# EAGLE design ESP32 TFT Touch with camera v1.2(3.5'' ili9488) (EAGLE 6.1)
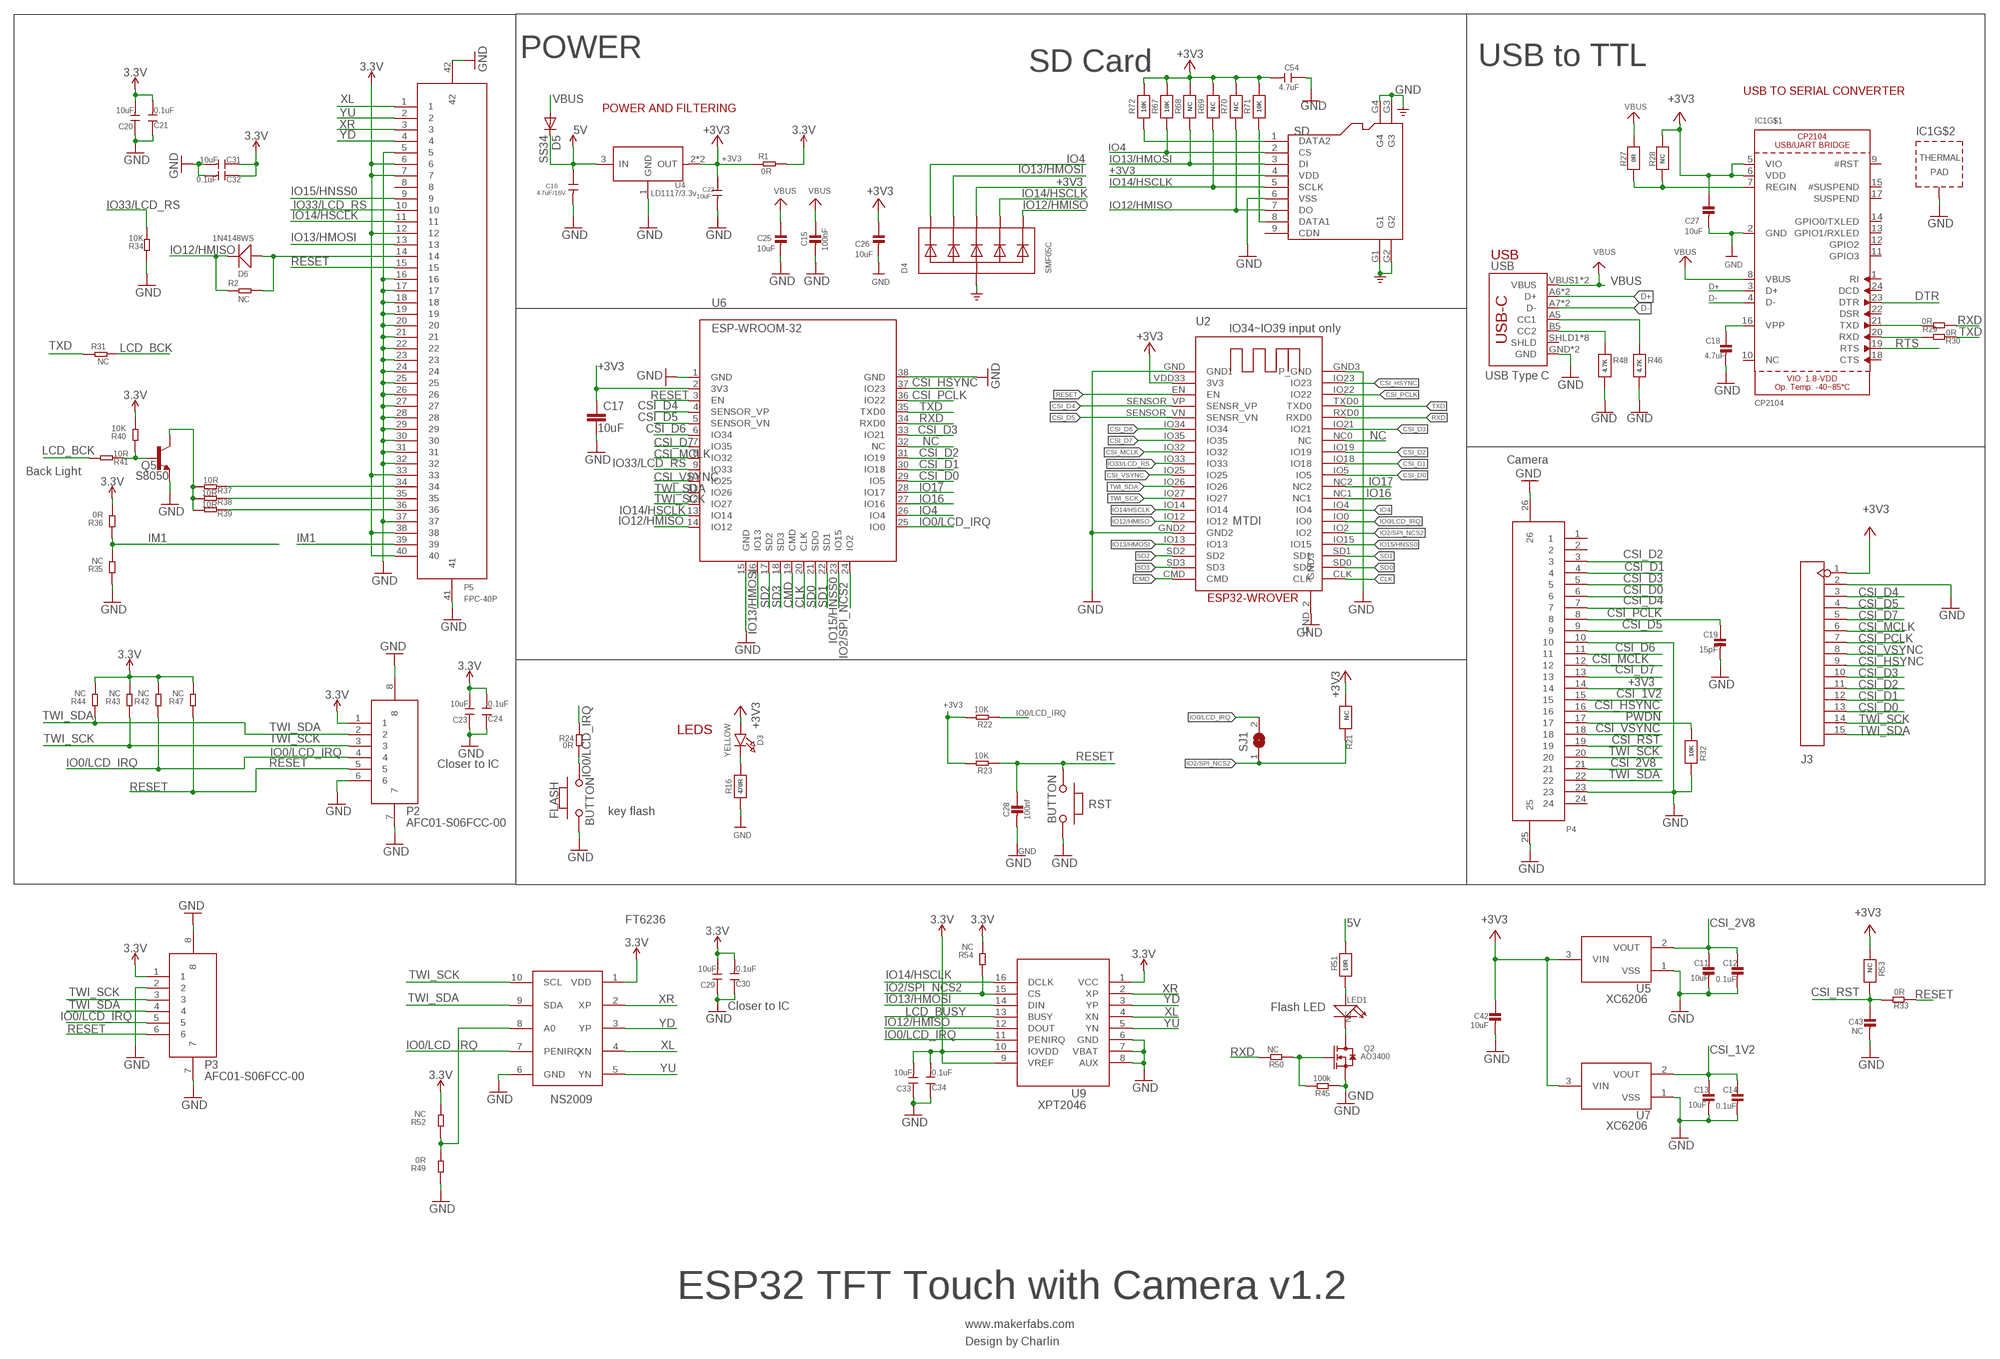
[diagram p0: schematic, sheet 1, part 1 of 2]
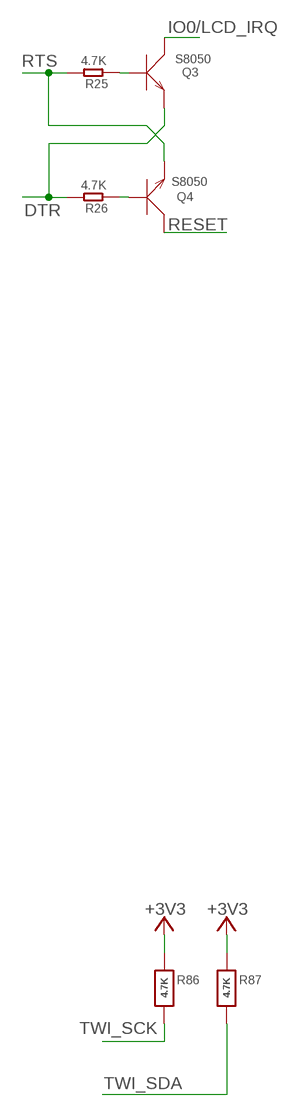
[diagram p1: schematic, sheet 1, part 2 of 2]

## Parts
C11  10uF  CAP_CERAMIC0603_NO  [0603-NO]
C12  0.1uF  CAP_CERAMIC0603_NO  [0603-NO]
C13  10uF  CAP_CERAMIC0603_NO  [0603-NO]
C14  0.1uF  CAP_CERAMIC0603_NO  [0603-NO]
C15  100nF  CAP_CERAMIC0603_NO  [0603-NO]
C16  4.7uF/16V  C-0603  [0603]
C17  10uF  C-EUC0603  [C0603]
C18  4.7uF  CAP_CERAMIC0603_NO  [0603-NO]
C19  15pF  CAP_CERAMIC0603_NO  [0603-NO]
C20  10uF  DISCRETE_C-0603  [DISCRETE_C0603]
C21  0.1uF  DISCRETE_C-0603  [DISCRETE_C0603]
C22  10uF  C-0603  [0603]
C23  10uF  DISCRETE_C-0603  [DISCRETE_C0603]
C24  0.1uF  DISCRETE_C-0603  [DISCRETE_C0603]
C25  10uF  CAP_CERAMIC0603_NO  [0603-NO]
C26  10uF  CAP_CERAMIC0603_NO  [0603-NO]
C27  10uF  CAP_CERAMIC0603_NO  [0603-NO]
C28  100nf  CAP_CERAMIC0603_NO  [0603-NO]
C29  10uF  DISCRETE_C-0603  [DISCRETE_C0603]
C30  0.1uF  DISCRETE_C-0603  [DISCRETE_C0603]
C31  10uF  DISCRETE_C-0603  [DISCRETE_C0603]
C32  0.1uF  DISCRETE_C-0603  [DISCRETE_C0603]
C33  10uF  DISCRETE_C-0603  [DISCRETE_C0603]
C34  0.1uF  DISCRETE_C-0603  [DISCRETE_C0603]
C42  10uF  CAP_CERAMIC0603_NO  [0603-NO]
C43  NC  CAP_CERAMIC0603_NO  [0603-NO]
C54  4.7uF  DISCRETE_C-0603  [DISCRETE_C0603]
D3  YELLOW  LED0805_NOOUTLINE  [CHIPLED_0805_NOOUTLINE]
D4  SMF05C  TVSARRAY_5LANE  [SOT363]
D5  SS34  DIODE-DO-214AC  [DO-214AC]
D6  1N4148WS  D'0805'  [SOD323]
FLASH  BUTTON  PB157  [157SW]
IC1  CP2104  [QFN24_4MM_SMSC]
J3  HEADER-1X15P  [SMD15-2.54P8.5H]
LED1  NC  DISCRETE_LED3528  [DISCRETE_LED-3528]
P2  AFC01-S06FCC-00  [SMD8-50P-740L535W]
P3  AFC01-S06FCC-00  [SMD8-50P-740L535W]
P4  FPC-24P  [SMD26-50P-1760L450W]
P5  FPC-40P  [SMD42-50P-2560L490W]
Q2  AO3400  MOSFET-N'SOT23'  [SOT23@1]
Q3  S8050  TRANSISTOR-NPN-SOT23  [SOT23]
Q4  S8050  TRANSISTOR-NPN-SOT23  [SOT23]
Q5  S8050  SPARKFUN_TRANSISTOR_NPNSOT23  [SPARKFUN_SOT23]
R1  0R  R-0603  [R0603]
R2  NC  R-0603  [R0603]
R16  470R  RESISTOR_0603_NOOUT  [0603-NO]
R21  NC  RESISTOR_0603_NOOUT  [0603-NO]
R22  10K  R-0603  [R0603]
R23  10K  R-0603  [R0603]
R24  0R  R-0603  [R0603]
R25  4.7K  R-0603  [R0603]
R26  4.7K  R-0603  [R0603]
R27  0R  RESISTOR_0603_NOOUT  [0603-NO]
R28  NC  RESISTOR_0603_NOOUT  [0603-NO]
R29  0R  R-0603  [R0603]
R30  0R  R-0603  [R0603]
R31  NC  R-0603  [R0603]
R32  10K  RESISTOR_0603_NOOUT  [0603-NO]
R33  0R  R-0603  [R0603]
R34  10K  DISCRETE_R-0603  [DISCRETE_R0603]
R35  NC  DISCRETE_R-0603  [DISCRETE_R0603]
R36  0R  DISCRETE_R-0603  [DISCRETE_R0603]
R37  10R  DISCRETE_R-0603  [DISCRETE_R0603]
R38  10R  DISCRETE_R-0603  [DISCRETE_R0603]
R39  10R  DISCRETE_R-0603  [DISCRETE_R0603]
R40  10K  DISCRETE_R-0603  [DISCRETE_R0603]
R41  10R  DISCRETE_R-0603  [DISCRETE_R0603]
R42  NC  DISCRETE_R-0603  [DISCRETE_R0603]
R43  NC  DISCRETE_R-0603  [DISCRETE_R0603]
R44  NC  DISCRETE_R-0603  [DISCRETE_R0603]
R45  100k  R-0603  [R0603]
R46  4.7K  RESISTOR_0603_NOOUT  [0603-NO]
R47  NC  DISCRETE_R-0603  [DISCRETE_R0603]
R48  4.7K  RESISTOR_0603_NOOUT  [0603-NO]
R49  0R  DISCRETE_R-0603  [DISCRETE_R0603]
R50  NC  R-0603  [R0603]
R51  10R  RESISTOR_0603_NOOUT  [0603-NO]
R52  NC  DISCRETE_R-0603  [DISCRETE_R0603]
R53  NC  RESISTOR_0603_NOOUT  [0603-NO]
R54  NC  DISCRETE_R-0603  [DISCRETE_R0603]
R67  10K  RESISTOR_0603_NOOUT  [0603-NO]
R68  NC  RESISTOR_0603_NOOUT  [0603-NO]
R69  NC  RESISTOR_0603_NOOUT  [0603-NO]
R70  NC  RESISTOR_0603_NOOUT  [0603-NO]
R71  10K  RESISTOR_0603_NOOUT  [0603-NO]
R72  10K  RESISTOR_0603_NOOUT  [0603-NO]
R86  4.7K  RESISTOR_0603_NOOUT  [0603-NO]
R87  4.7K  RESISTOR_0603_NOOUT  [0603-NO]
RST  BUTTON  PB157  [157SW]
SD  HOLDER-MICROSD-9P  [9P-SMD-W/-RING]
SJ1  SJ  [SJ]
U2  ESP32-WROVER  [ESP32-WROVER]
U4  LD1117/3.3v  LD1117'SOT89'  [SOT89]
U5  XC6206  [SOT-23]
U6  ESP-WROOM-32  [ESP-WROOM-32]
U7  XC6206  [SOT-23]
U8  NS2009  [MSOP10]
U9  XPT2046  [TSSOP16-65P-560L910W]
USB  USB_C5  [USB-C-16P-5]

## Nets
3.3V: C20.2 C21.2 C23.2 C24.2 C29.2 C30.2 C31.1 C32.1 C33.2 C34.2 P2.1 P3.1 P5.6 P5.7 P5.12 P5.33 P5.38 P5.40 R1.2 R36.2 R40.2 R42.2 R43.2 R44.2 R47.2 R52.2 R54.2 U8.1(VDD) U9.1(VCC) U9.9(VREF) U9.10(IOVDD)
5V: C16.1 D5.C R51.1 U4.3(IN)
+3V3: C17.1 C22.1 C26.1 C27.1 C42.1 C54.2 D3.A D4.4(C3) IC1.5(VIO) IC1.6(VDD) J3.1 P4.14 R1.1 R21.1 R22.2 R23.2 R28.1 R53.1 R67.2 R68.2 R69.2 R70.2 R71.2 R72.2 R86.1 R87.1 SD.4(VDD) U2.VDD33(3V3) U4.2(OUT) U4.4(OUT) U5.3(VIN) U6.2(3V3) U7.3(VIN)
CLK: U2.CLK U6.20(CLK)
CMD: U2.CMD U6.19(CMD)
CSI_1V2: C13.1 C14.1 P4.15 U7.2(VOUT)
CSI_2V8: C11.1 C12.1 P4.21 U5.2(VOUT)
CSI_D0: J3.13 P4.6 U2.IO5 U6.29(IO5)
CSI_D1: J3.12 P4.4 U2.IO18 U6.30(IO18)
CSI_D2: J3.11 P4.3 U2.IO19 U6.31(IO19)
CSI_D3: J3.10 P4.5 U2.IO21 U6.33(IO21)
CSI_D4: J3.3 P4.7 U2.SENSOR_VP(SENSR_VP) U6.4(SENSOR_VP)
CSI_D5: J3.4 P4.9 U2.SENSOR_VN(SENSR_VN) U6.5(SENSOR_VN)
CSI_D6: P4.11 U2.IO34 U6.6(IO34)
CSI_D7: J3.5 P4.13 U2.IO35 U6.7(IO35)
CSI_HSYNC: J3.9 P4.16 U2.IO23 U6.37(IO23)
CSI_MCLK: J3.6 P4.12 U2.IO32 U6.8(IO32)
CSI_PCLK: C19.1 J3.7 P4.8 U2.IO22 U6.36(IO22)
CSI_RST: C43.1 P4.19 R33.2 R53.2
CSI_VSYNC: J3.8 P4.18 U2.IO25 U6.10(IO25)
D+: IC1.3(D+) USB.A6(D+) USB.B6(D+)
D-: IC1.4(D-) USB.A7(D-) USB.B7(D-)
DTR: IC1.23(DTR) Q3.2(E) R26.2
GND: C11.2 C12.2 C13.2 C14.2 C15.2 C16.2 C17.2 C18.2 C19.2 C20.1 C21.1 C22.2 C23.1 C24.1 C25.2 C26.2 C27.2 C28.2 C29.1 C30.1 C31.2 C32.2 C33.1 C34.1 C42.2 C43.2 C54.1 D4.2(A) FLASH.1 IC1.2(GND) IC1.THERM(TP) J3.2 P2.6 P2.7 P2.8 P3.2 P3.7 P3.8 P4.10 P4.23 P4.25 P4.26 P5.5 P5.16 P5.17 P5.18 P5.19 P5.20 P5.21 P5.22 P5.23 P5.24 P5.25 P5.26 P5.27 P5.28 P5.29 P5.30 P5.31 P5.32 P5.37 P5.41 P5.42 Q2.2(S) Q5.2(E) R16.1 R32.2 R34.1 R35.1 R45.1 R46.2 R48.2 R49.1 RST.1 SD.6(VSS) SD.G1 SD.G2 SD.G3 SD.G4 U2.GND2 U2.GND3(P_GND) U2.GND(GND1) U2.GND_2(GND3) U4.1(GND) U5.1(VSS) U6.1(GND) U6.15(GND) U6.38(GND) U7.1(VSS) U8.6(GND) U9.6(GND) U9.7(VBAT) U9.8(AUX) USB.GND USB.GND2(GND)
IM1: P5.39 R35.2 R36.1
IO0/LCD_IRQ: P2.4 P3.5 Q3.3(C) R22.1 R24.2 R42.1 SJ1.2 U2.IO0 U6.25(IO0) U8.7(PENIRQ) U9.11(PENIRQ)
IO2/SPI_NCS2: R21.2 R54.1 SJ1.1 U2.IO2 U6.24(IO2) U9.15(CS)
IO4: D4.1(C1) R67.1 SD.2(CS) U2.IO4 U6.26(IO4)
IO12/HMISO: D4.6(C5) D6.- R2.1 R70.1 SD.7(DO) U2.IO12 U6.14(IO12) U9.12(DOUT)
IO13/HMOSI: D4.3(C2) P5.13 R68.1 SD.3(DI) U2.IO13 U6.16(IO13) U9.14(DIN)
IO14/HSCLK: D4.5(C4) P5.11 R69.1 SD.5(SCLK) U2.IO14 U6.13(IO14) U9.16(DCLK)
IO15/HNSS0: P5.9 U2.IO15 U6.23(IO15)
IO16: U2.NC1 U6.27(IO16)
IO17: U2.NC2 U6.28(IO17)
IO33/LCD_RS: P5.10 R34.2 U2.IO33 U6.9(IO33)
LCD_BCK: R31.2 R41.2
LCD_BUSY: U9.13(BUSY)
N$1: C18.1 IC1.16(VPP)
N$2: Q4.1(B) R26.1
N$3: Q3.1(B) R25.1
N$4: D6.+ P5.14 R2.2
N$5: Q2.1(G) R45.2 R50.1
N$6: FLASH.2 R24.1
N$7: D3.C R16.2
N$8: LED1.1(+) R51.2
N$9: LED1.2(-) Q2.3(D)
N$10: R46.1 USB.A5(CC1)
N$11: R48.1 USB.B5(CC2)
N$12: IC1.7(REGIN) R27.2 R28.2
N$18: IC1.21(TXD) R29.2
N$19: IC1.20(RXD) R30.2
N$20: P5.34 R37.1
N$21: P5.35 R38.1
N$22: P5.36 R39.1
N$23: Q5.1(B) R40.1 R41.1
N$24: Q5.3(C) R37.2 R38.2 R39.2
N$25: R49.2 R52.1 U8.8(A0)
N$47: R72.1 SD.1(DATA2)
N$48: R71.1 SD.8(DATA1)
NC: U2.NC0(NC) U6.32(NC)
PWDN: P4.17 R32.1
RESET: C28.1 P2.5 P3.6 P5.15 Q4.3(C) R23.1 R33.1 R47.1 RST.2 U2.EN U6.3(EN)
RTS: IC1.19(RTS) Q4.2(E) R25.2
RXD: R29.1 R50.2 U2.RXD0 U6.34(RXD0)
SD0: U2.SD0 U6.21(SDO)
SD1: U2.SD1 U6.22(SD1)
SD2: U2.SD2 U6.17(SD2)
SD3: U2.SD3 U6.18(SD3)
TWI_SCK: J3.14 P2.3 P3.3 P4.20 R43.1 R86.2 U2.IO27 U6.12(IO27) U8.10(SCL)
TWI_SDA: J3.15 P2.2 P3.4 P4.22 R44.1 R87.2 U2.IO26 U6.11(IO26) U8.9(SDA)
TXD: R30.1 R31.1 U2.TXD0 U6.35(TXD0)
VBUS: C15.1 C25.1 D5.A IC1.8(VBUS) R27.1 USB.VBUS1(VBUS) USB.VBUS2(VBUS)
XL: P5.1 U8.4(XN) U9.4(XN)
XR: P5.3 U8.2(XP) U9.2(XP)
YD: P5.4 U8.3(YP) U9.3(YP)
YU: P5.2 U8.5(YN) U9.5(YN)
Unconnected: IC1.1(RI) IC1.9(#RST) IC1.10(NC) IC1.11(GPIO3) IC1.12(GPIO2) IC1.13(GPIO1/RXLED) IC1.14(GPIO0/TXLED) IC1.15(#SUSPEND) IC1.17(SUSPEND) IC1.18(CTS) IC1.22(DSR) IC1.24(DCD) P4.1 P4.2 P4.24 P5.8 SD.9(CDN) USB.SHLD1(SHLD) USB.SHLD2(SHLD) USB.SHLD3(SHLD) USB.SHLD4(SHLD) USB.SHLD5(SHLD) USB.SHLD6(SHLD) USB.SHLD7(SHLD) USB.SHLD8(SHLD)

## Notes on the sheet
- POWER | USB to TTL
- SD Card
- USB TO SERIAL CONVERTER
- POWER AND FILTERING
- USB
- IO34~IO39 input only
- USB Type C
- Camera
- Back Light
- MTDI
- LEDS
- Closer to IC
- key flash
- FT6236
- Closer to IC | Flash LED
- NS2009
- ESP32 TFT Touch with Camera v1.2
- www.makerfabs.com
- Design by Charlin

## Library data of the parts
C11-C15 C18 C19 C25-C28 C42 C43 = microbuilder:CAP_CERAMIC: Ceramic Capacitors For new designs, use the packages preceded by an '_' character since they are more reliable: The following footprints should be used on most boards: _0402 - Standard footprint for regular board layouts _0603 - Standard footprint for regular board layouts _0805 - Standard footprint for regular board layouts _1206 - Standard footprint for regular board layouts For extremely tight-pitch boards where space is at a premium, the following 'micro-pitch' footprints can be used (smaller pads, no silkscreen outline, etc.): _0402MP - Micro-pitch footprint for very dense/compact boards _0603MP - Micro-pitch footprint for very dense/compact boards _0805MP - Micro-pitch footprint for very dense/compact boards _1206MP - Micro-pitch footprint for very dense/compact boards
C16 C22 = Discrete:C*: Ceramic Capacitors
C17 = rcl:C-EU: CAPACITOR, European symbol
C20 C21 C23 C24 C29-C34 C54 = A9G:DISCRETE_C*: Ceramic Capacitors
D3 = microbuilder:LED: LED 0603 - 0603 Surface Mount Package 2mA: Green LED - Low Power (3.9mcd, 2ma, 1.7Vf) - Digikey: 475-2709-2-ND Orange LED - Low Power (9.8mcd, 2ma, 1.8Vf) - Digikey: 475-1194-2-ND Red LED - Low Power (5mcd, 2ma, 1.8Vf) - Digikey: 475-1195-2-ND Yellow LED - Low Power (7mcd, 2ma, 1.8Vf) - Digikey: 475-1196-2-ND 5mA: Blue LED - Low Power (17mcd, 5ma, 2.9Vf) - Digikey: LNJ937W8CRACT-ND 0805 - 0805 Surface Mount Package 2mA: Red LED (8.8mcd, 2mA, 1.8Vf, Clear) - Low Power [Digikey: 475-2510-1-ND] Green LED (5mcd, 2mA, 1.8Vf, Clear) - Low Power [Digikey: 475-2730-1-ND] Yellow LED (11.3mcd, 2mA, 1.8Vf, Clear) - Low Power [Digikey: 475-2555-1-ND] 20mA: Red LED (104mcd, 20mA, Diffused) - LS R976 [Digikey: 475-1278-6-ND] Red LED (12mcd, 20mA, 2.0Vf, Clear) - APT2012EC [Digikey: 754-1128-1-ND] Green LED (15mcd, 20mA, 2.2Vf, Clear) - APT2012GC [Digikey: 754-1131-1-ND] Orange LED (160mcd, 20mA, 2.1Vf, Clear) - APT2012SECK [Digikey: 754-1130-1-ND] 1206 - 1206 Surface Mount Package Green LED (26mcd, 20mA, Diffused) - LG N971 [Digikey: 475-1407-6-ND] Red LED (15mcd, 20mA, Diffused) - LH N974 [Digikey: 475-1416-6-ND] Cree - Cree High-Power Surface Mount LEDs XPEBWT-L1-0000-00D50 - White 111lm 350mA 2.9Vf 6200K 110° XTEAWT-00-0000-00000LEE3 - White 114lm 350mA 2.85Vf 5000K 115° Everlight - Everlight 45-21 Series Surface Mount LEDs 45-21/QK2C-B2832AC2CB2/2T - Warm White 2000mcd 20mA 3.25Vf 3050K 120° 45-21/LK2C-B38452C4CB2/2T - Nuetral White 2000mcd 20mA 3.25Vf 4150K 120° 45-21/LK2C-B50634C6CB2/2T - Cold White 2200mcd 20mA 3.25Vf 5650K 120° PLCC2 Reverse Mount LS T77K-J1L2-1-0-2-R18-Z - Red 11.25mcd 2mA 1.8Vf 630nm 120° LO T77K-L1M2-24-Z - Orange 19.6mcd 2mA 1.8Vf 606nm 120° LY T77K-K2M1-26-Z - Yellow 15.7mcd 2mA 1.8Vf 587nm 120°
D4 = microbuilder:TVSARRAY_5LANE: Voltage Transient Suppressor Array SOT363 SMF05C - 100W 5V: Digikey - SMF05CT1GOSCT-ND
D5 = diode:DIODE-: DIODE
D6 = Discrete:D*
FLASH RST = MySMD:PB157
IC1 = microbuilder:CP2104: CP2104 - USB to UART Bridge VDD Output: 3.45V
J3 = self:HEADER-1X15P
LED1 = Relay:DISCRETE_LED*
P2 P3 = self:AFC01-S06FCC-00
P4 = self:FPC-24P
P5 = self:FPC-40P
Q2 = Discrete:MOSFET-N: IRLL014: http://www.vishay.com/docs/91319/sihll014.pdf
Q3 Q4 = Discrete:TRANSISTOR-NPN*: NPN audion
Q5 = Adafruit_HUZZAH32_ESP32_Feather:SPARKFUN_TRANSISTOR_NPN: Transistor NPN BJT configuration in SOT23 package. MMBT2222 is the common NPN we use. Double check BCE configuration again layout.
R1 R2 R22-R26 R29-R31 R33 R45 R50 = Discrete:R*
R16 R21 R27 R28 R32 R46 R48 R51 R53 R67-R72 R86 R87 = microbuilder:RESISTOR: Resistors For new designs, use the packages preceded by an '_' character since they are more reliable: The following footprints should be used on most boards: _0402 - Standard footprint for regular board layouts _0603 - Standard footprint for regular board layouts _0805 - Standard footprint for regular board layouts _1206 - Standard footprint for regular board layouts For extremely tight-pitch boards where space is at a premium, the following 'micro-pitch' footprints can be used (smaller pads, no silkscreen outline, etc.): _0402MP - Micro-pitch footprint for very dense/compact boards _0603MP - Micro-pitch footprint for very dense/compact boards _0805MP - Micro-pitch footprint for very dense/compact boards _1206MP - Micro-pitch footprint for very dense/compact boards
R34-R44 R47 R49 R52 R54 = A9G:DISCRETE_R*
SD = Connector:HOLDER-MICROSD-9P
SJ1 = jumper:SJ: SMD solder JUMPER
U2 = ESP32-Wrover:ESP32-WROVER
U4 = IC:LD1117: Low Drop Fixed And Adjustable Positive Voltage Regulators http://www.datasheetcatalog.org/datasheet/SGSThomsonMicroelectronics/mXuqtqv.pdf
U5 U7 = self:XC6206
U6 = ESP32:ESP-WROOM-32
U8 = NS2009:NS2009
U9 = self:XPT2046
USB = USBC:USB_C: USB Type C 16Pin Connector Super Speed pins not available on the 16-pin purely SMD connector so this part is best for USB 2.0 implementations. D1 and D2 are tied together enabling D+/- no matter which way the cable is plugged into the connector. The two channel configuration pins (CC1/2) are exposed. These are normally connected to ground via 5.1k resistors but can be reconfigured for high current/high power applications.

## Net classes
0 default: width 0.203 mm, drill 0.305 mm, clearance 0.152 mm
1 vbat: width 0.254 mm, drill 0.305 mm, clearance 0.152 mm

## Board
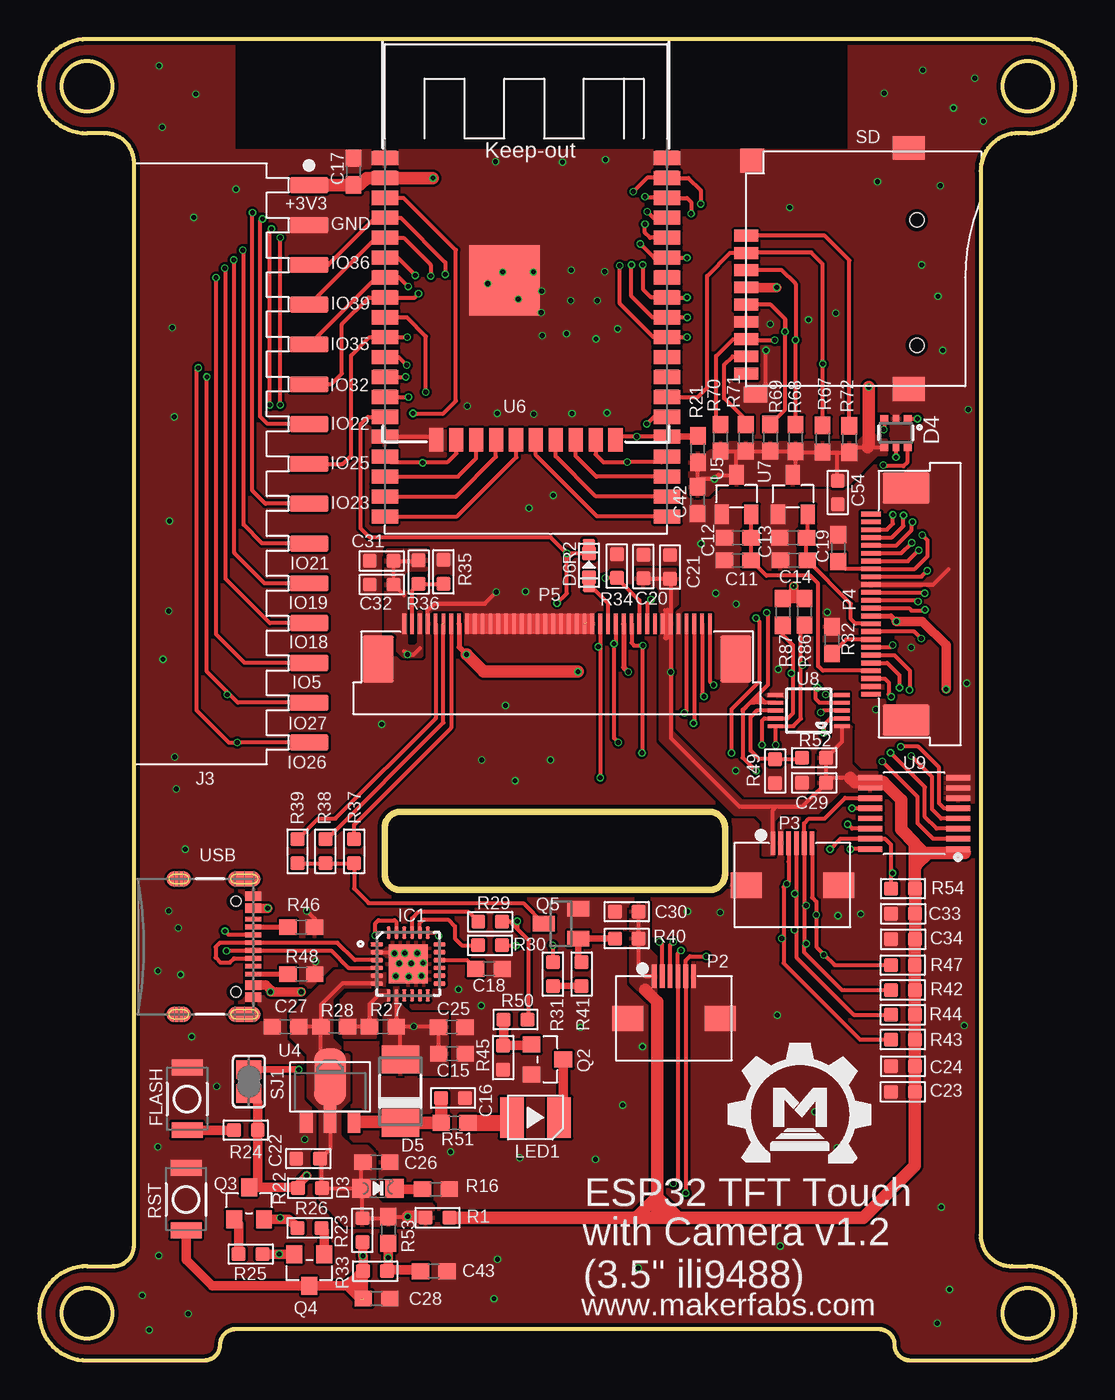
[diagram p2: board, top side]
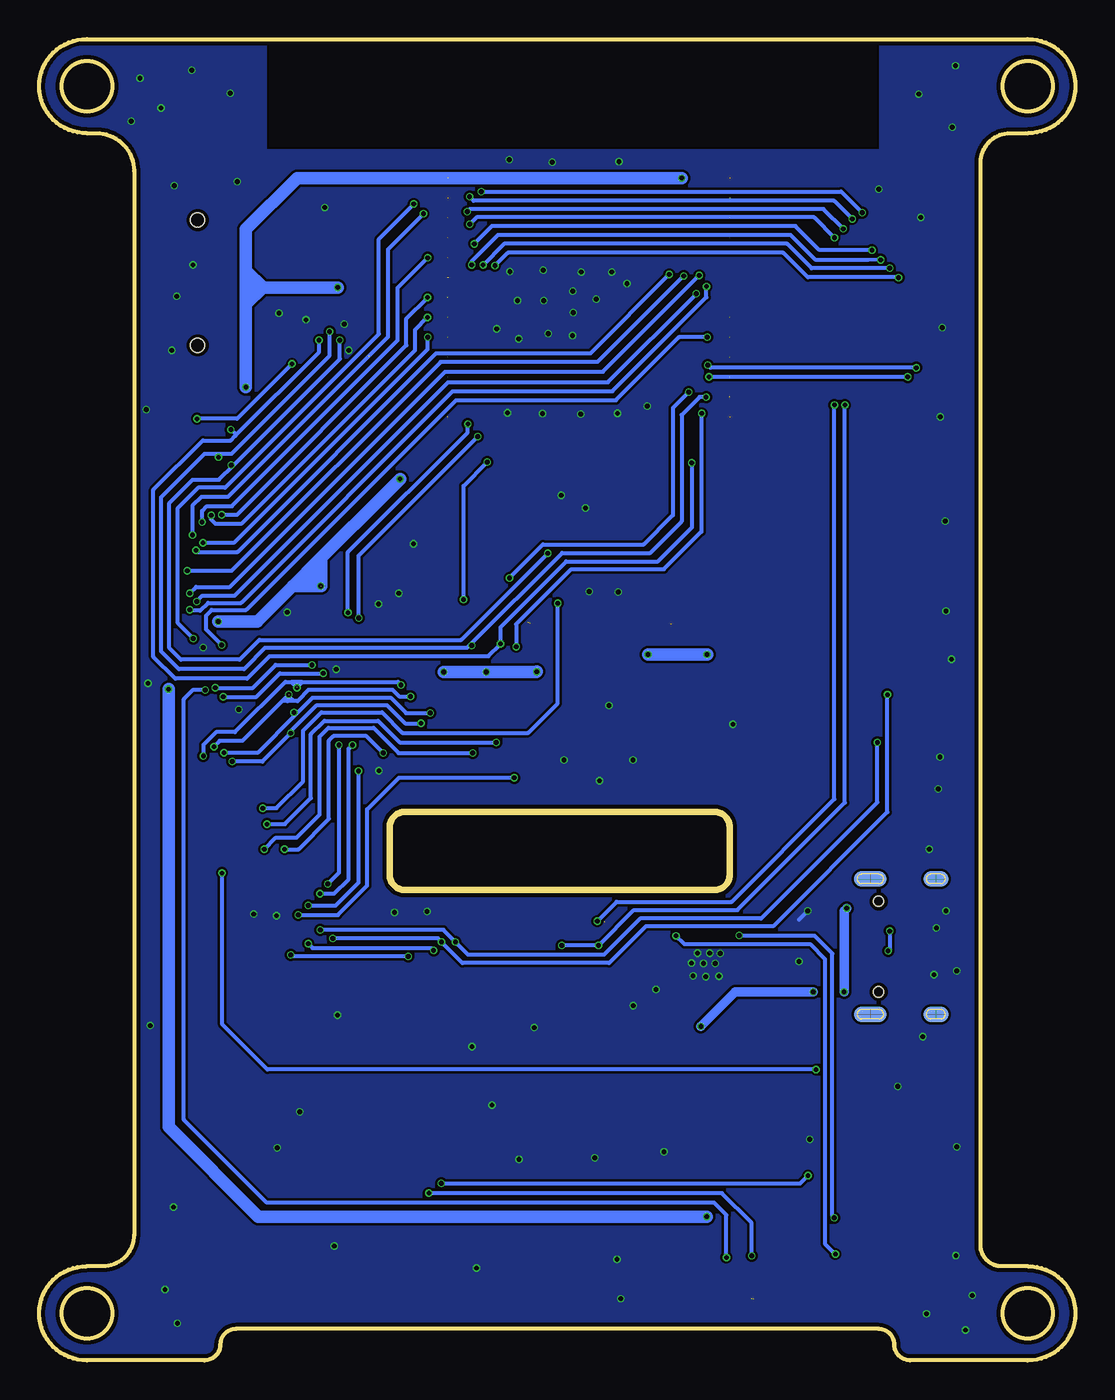
[diagram p3: board, bottom side, seen from below]

Size 66.1 x 84.3 mm. Coordinates in mm from the lower left corner, seen from the top.
Outline: 55.55,0 63.05,0 arc182 63.05,6 62.05,6 arc-90 60.05,8 60.05,75.9 arc-90 62.45,78.3 63.05,78.3 arc182 63.05,84.3 3.05,84.3 arc182 3.05,78.3 4.17,78.3 arc-90 6.05,76.42 6.05,7.34 arc-90 4.7,6 3.05,6 arc182 3.05,0 10.55,0 arc90 11.55,1 arc-90 12.55,2 53.55,2 arc-90 54.55,1 arc90 55.55,0
Outline: 23.05,35 42.75,35 arc-90 43.75,34 43.75,31 arc-90 42.75,30 23.05,30 arc-90 22.05,31 22.05,34 arc-90 23.05,35
Outline: circle at 3.05,81.3 radius 1.6
Outline: circle at 3.05,3 radius 1.6
Outline: circle at 63.05,3 radius 1.6
Outline: circle at 63.05,81.3 radius 1.6
Copper layers (1*16): Top 0.035mm / dielectric 1.5mm / Bottom 0.035mm
Design rules: minimum track width 6mil, minimum drill 10mil, track to track 6mil, track to pad 6mil, pad to pad 6mil, via to via 6mil, smd to smd 0mil, copper to edge 10mil, drill to drill 10mil, minimum pad ring 3mil, minimum via ring 3mil, stop-mask expansion 2mil, vias tented up to drill 100mil, thermal gap 0mil
tRestrict: area 12.5,77.3 to 51.5,85
bRestrict: area 12.5,77.3 to 51.5,85

### Footprints (pad centres in the part's own frame; a part is rotated, then mirrored left to right if it is on the bottom)
0603-NO = smd 1.1 x 1: 1 -0.85,0; 2 0.85,0
0603 = smd 0.889 x 0.889: 1 -0.762,0; 2 0.762,0
C0603 = smd 1.1 x 1: 1 -0.85,0; 2 0.85,0
DISCRETE_C0603 = smd 0.889 x 0.889: 1 -0.762,0; 2 0.762,0
CHIPLED_0805_NOOUTLINE = smd 1.2 x 1.2: A 0,-1.05; C 0,1.05
SOT363 = smd 0.5 x 0.5: 1 -0.75,-0.9; 3 0.75,-0.9; 4 0.75,0.9; 6 -0.75,0.9 | smd 0.4 x 0.5: 2 0,-0.9; 5 0,0.9
DO-214AC = smd 1.8 x 2.4: A 2.025,0; C -2.025,0
SOD323 = smd 1 x 0.8: + -1.2,0; - 1.2,0
157SW = smd 1.016 x 1.981: 1 0,0; 2 4,0
QFN24_4MM_SMSC = smd 0.8 x 0.28: 1 -2,1.25; 2 -2,0.75; 3 -2,0.25; 4 -2,-0.25; 5 -2,-0.75; 6 -2,-1.25; 13 2,-1.25; 14 2,-0.75; 15 2,-0.25; 16 2,0.25; 17 2,0.75; 18 2,1.25 | smd 0.28 x 0.8: 7 -1.25,-2; 8 -0.75,-2; 9 -0.25,-2; 10 0.25,-2; 11 0.75,-2; 12 1.25,-2; 19 1.25,2; 20 0.75,2; 21 0.25,2; 22 -0.25,2; 23 -0.75,2; 24 -1.25,2 | smd 2.5 x 2.5: THERM 0,0
SMD15-2.54P8.5H = smd 1.02 x 2.5: 1 -17.78,0; 2 -15.24,0; 3 -12.7,0; 4 -10.16,0; 5 -7.62,0; 6 -5.08,0; 7 -2.54,0; 8 0,0; 9 2.54,0; 10 5.08,0; 11 7.62,0; 12 10.16,0; 13 12.7,0; 14 15.24,0; 15 17.78,0
DISCRETE_LED-3528 = smd 1.5 x 2.6: 1 -1.5,0; 2 1.5,0
SMD8-50P-740L535W = smd 0.3 x 1.5: 1 -1.25,0; 2 -0.75,0; 3 -0.25,0; 4 0.25,0; 5 0.75,0; 6 1.25,0 | smd 2 x 1.6: 7 2.95,-2.68; 8 -2.95,-2.68
SMD26-50P-1760L450W = smd 0.3 x 1.3: 1 5.75,0; 2 5.25,0; 3 4.75,0; 4 4.25,0; 5 3.75,0; 6 3.25,0; 7 2.75,0; 8 2.25,0; 9 1.75,0; 10 1.25,0; 11 0.75,0; 12 0.25,0; 13 -0.25,0; 14 -0.75,0; 15 -1.25,0; 16 -1.75,0; 17 -2.25,0; 18 -2.75,0; 19 -3.25,0; 20 -3.75,0; 21 -4.25,0; 22 -4.75,0; 23 -5.25,0; 24 -5.75,0 | smd 2 x 3: 25 -7.4,-2.25; 26 7.4,-2.25
SMD42-50P-2560L490W = smd 0.3 x 1.3: 1 9.75,0; 2 9.25,0; 3 8.75,0; 4 8.25,0; 5 7.75,0; 6 7.25,0; 7 6.75,0; 8 6.25,0; 9 5.75,0; 10 5.25,0; 11 4.75,0; 12 4.25,0; 13 3.75,0; 14 3.25,0; 15 2.75,0; 16 2.25,0; 17 1.75,0; 18 1.25,0; 19 0.75,0; 20 0.25,0; 21 -0.25,0; 22 -0.75,0; 23 -1.25,0; 24 -1.75,0; 25 -2.25,0; 26 -2.75,0; 27 -3.25,0; 28 -3.75,0; 29 -4.25,0; 30 -4.75,0; 31 -5.25,0; 32 -5.75,0; 33 -6.25,0; 34 -6.75,0; 35 -7.25,0; 36 -7.75,0; 37 -8.25,0; 38 -8.75,0; 39 -9.25,0; 40 -9.75,0 | smd 2 x 3: 41 -11.4,-2.25; 42 11.4,-2.25
SOT23@1 = smd 1.016 x 1.143: 1 -0.95,-1.016; 2 0.95,-1.016; 3 0,1.016
SOT23 = smd 1.016 x 1.143: 1 -0.95,-1.016; 2 0.95,-1.016; 3 0,1.016
SPARKFUN_SOT23 = smd 1 x 1.4: 1 -0.95,-1.1; 2 0.95,-1.1; 3 0,1.1
R0603 = smd 0.889 x 0.889: 1 -0.762,0; 2 0.762,0
DISCRETE_R0603 = smd 0.889 x 0.889: 1 -0.762,0; 2 0.762,0
9P-SMD-W/-RING = smd 1.524 x 0.762: 1 0,4.4; 2 0,3.3; 3 0,2.2; 4 0,1.1; 5 0,0; 6 0,-1.1; 7 0,-2.2; 8 0,-3.3; 9 0,-4.4 | smd 1.524 x 1.016: G1 0.6,-5.746 | smd 2.032 x 1.524: G2 10.373,-5.4; G3 10.373,10 | smd 1.524 x 1.524: G4 0.392,9.181 | hole 0.889: 10.9,-2.6; 10.9,5.4
SJ = smd 1.168 x 1.6: 1 -0.762,0; 2 0.762,0
ESP32-WROVER = smd 1.7 x 0.9: CLK 18,1.27; CMD 0,1.27; EN 0,21.59; GND 0,24.13; GND3 18,24.13; GND_2 0,6.35; IO0 18,7.62; IO2 18,6.35; IO4 18,8.89; IO5 18,12.7; IO12 0,7.62; IO13 0,5.08; IO14 0,8.89; IO15 18,5.08; IO18 18,13.97; IO19 18,15.24; IO21 18,17.78; IO22 18,21.59; IO23 18,22.86; IO25 0,12.7; IO26 0,11.43; IO27 0,10.16; IO32 0,15.24; IO33 0,13.97; IO34 0,17.78; IO35 0,16.51; NC0 18,16.51; NC1 18,10.16; NC2 18,11.43; RXD0 18,19.05; SD0 18,2.54; SD1 18,3.81; SD2 0,3.81; SD3 0,2.54; SENSOR_VN 0,19.05; SENSOR_VP 0,20.32; TXD0 18,20.32; VDD33 0,22.86 | smd 4.5 x 4.5: GND2 7.62,16.34
SOT89 = smd 0.8 x 1.4: 1 -1.524,-1.905; 3 1.524,-1.905 | smd 0.8 x 1.9: 2 0,-1.651 | smd 2.032 x 3.65: 4 0,0.94
SOT-23 = smd 0.9 x 1.25: 1 -0.95,-1.25; 2 0.95,-1.25; 3 0,1.25
ESP-WROOM-32 = smd 0.9 x 1.5: 1 7.7,9; 2 6.43,9; 3 5.16,9; 4 3.89,9; 5 2.62,9; 6 1.35,9; 7 0.08,9; 8 -1.19,9; 9 -2.46,9; 10 -3.73,9; 11 -5,9; 12 -6.27,9; 13 -7.54,9; 14 -8.81,9; 25 -8.81,-9; 26 -7.54,-9; 27 -6.27,-9; 28 -5,-9; 29 -3.73,-9; 30 -2.46,-9; 31 -1.19,-9; 32 0.08,-9; 33 1.35,-9; 34 2.62,-9; 35 3.89,-9; 36 5.16,-9; 37 6.43,-9; 38 7.7,-9 | smd 1.5 x 0.9: 15 -10.3,5.715; 16 -10.3,4.445; 17 -10.3,3.175; 18 -10.3,1.905; 19 -10.3,0.635; 20 -10.3,-0.635; 21 -10.3,-1.905; 22 -10.3,-3.175; 23 -10.3,-4.445; 24 -10.3,-5.715
MSOP10 = smd 0.25 x 1: 1 -1,-2.113; 2 -0.5,-2.113; 3 0,-2.113; 4 0.5,-2.113; 5 1,-2.113; 6 1,2.113; 7 0.5,2.113; 8 0,2.113; 9 -0.5,2.113; 10 -1,2.113
TSSOP16-65P-560L910W = smd 1.6 x 0.35: 1 -2.8,2.275; 2 -2.8,1.625; 3 -2.8,0.975; 4 -2.8,0.325; 5 -2.8,-0.325; 6 -2.8,-0.975; 7 -2.8,-1.625; 8 -2.8,-2.275; 9 2.8,-2.275; 10 2.8,-1.625; 11 2.8,-0.975; 12 2.8,-0.325; 13 2.8,0.325; 14 2.8,0.975; 15 2.8,1.625; 16 2.8,2.275
USB-C-16P-5 = smd 0.3 x 1: A5 -1.25,-0.34; A6 -0.25,-0.34; A7 0.25,-0.34; A8 1.25,-0.34; B5 1.75,-0.34; B6 0.75,-0.34; B7 -0.75,-0.34; B8 -1.75,-0.34 | smd 0.6 x 1: GND -3.225,-0.34; GND2 3.225,-0.34; VBUS1 -2.45,-0.34; VBUS2 2.45,-0.34 | smd 1 x 2.1: SHLD1 -4.32,-0.915; SHLD2 4.32,-0.915 | smd 1 x 2.1 bottom: SHLD3 -4.32,-0.915; SHLD4 4.32,-0.915 | smd 1 x 1.6: SHLD5 -4.32,-5.095; SHLD8 4.32,-5.095 | smd 1 x 1.6 bottom: SHLD6 -4.32,-5.095; SHLD7 4.32,-5.095 | hole 0.65: -2.89,-1.445; 2.89,-1.445

### Placement (x,y rotation side)
C11  44.56,51.04 180 top
C12  44.56,52.49 180 top
C13  48.09,52.48 180 top
C14  48.13,51.06 180 top
C15  26.33,19.56 0 top
C16  26.4,16.74 0 top
C17  20.05,75.85 90 top
C18  28.69,24.98 0 top
C19  50.97,51.82 90 top
C20  38.54,50.65 270 top
C21  40.24,50.62 270 top
C22  17.16,12.87 180 top
C23  55.09,17.13 0 top
C24  55.09,18.77 0 top
C25  26.32,21.27 0 top
C26  21.51,12.64 0 top
C27  15.71,21.3 180 top
C28  21.52,3.94 0 top
C29  49.43,36.85 0 top
C30  37.48,28.63 0 top
C31  21.85,51.01 180 top
C32  21.85,49.5 180 top
C33  55.11,28.5 0 top
C34  55.11,26.86 0 top
C42  41.99,54.89 270 top
C43  25.17,5.68 0 top
C54  50.94,55.37 90 top
D3  21.61,10.97 270 top
D4  54.64,59.18 180 top
D5  23.04,17.17 90 top
D6  35.06,50.72 90 top
FLASH  9.44,18.69 270 top
IC1  23.54,25.29 0 top
J3  17.22,57.2 270 top
LED1  31.66,15.49 0 top
P2  40.49,24.5 0 top
P3  48.05,33 0 top
P4  53.05,48.25 90 top
P5  33.03,47 0 top
Q2  32.42,19.2 270 top
Q3  13.39,10.02 0 top
Q4  17.23,5.76 180 top
Q5  33.29,27.86 90 top
R1  25.41,9.1 0 top
R2  35.07,50.73 270 top
R16  25.3,10.92 180 top
R21  42.01,58.15 90 top
R22  17.27,10.98 0 top
R23  20.62,8.3 90 top
R24  13.18,14.69 0 top
R25  13.49,6.78 0 top
R26  17.25,8.45 180 top
R27  21.92,21.3 180 top
R28  18.82,21.3 0 top
R29  28.77,27.98 180 top
R30  28.76,26.48 180 top
R31  32.77,24.64 270 top
R32  50.58,45.96 90 top
R33  21.43,5.69 0 top
R34  36.85,50.68 270 top
R35  25.78,50.32 270 top
R36  24.21,50.3 90 top
R37  20.09,32.48 270 top
R38  18.25,32.48 270 top
R39  16.48,32.48 270 top
R40  37.48,26.91 0 top
R41  34.6,24.64 270 top
R42  55.09,23.63 0 top
R43  55.09,20.47 0 top
R44  55.09,22.05 0 top
R45  29.59,19.32 90 top
R46  16.72,27.64 0 top
R47  55.09,25.22 0 top
R48  16.73,24.64 0 top
R49  46.95,37.6 90 top
R50  30.38,21.75 0 top
R51  26.5,15.15 0 top
R52  49.43,38.45 0 top
R53  22.27,8.32 270 top
R54  55.1,30.09 0 top
R67  49.97,58.8 270 top
R68  48.25,58.86 270 top
R69  46.63,58.87 270 top
R70  43.46,58.86 270 top
R71  45.07,58.86 270 top
R72  51.67,58.78 270 top
R86  48.81,47.76 270 top
R87  47.43,47.76 270 top
RST  9.37,12.29 270 top
SD  45.09,67.36 0 top
SJ1  13.38,17.79 270 top
U2  22.05,52.58 0 top
U4  18.56,17.13 0 top
U5  44.48,55.24 0 top
U6  31.05,69.02 90 top
U7  48.07,55.24 0 top
U8  49.09,41.46 90 top
U9  55.81,34.9 180 top
U$1  [MAKERFABS_0.3]  44.41,12.63 0 top
USB  14,26.4 270 top

### Tracks (layer width: path | path; a pad name or v marks a point on that pad's centre or on a via)
3.3V  (via drill 0.3)
  Top 0.254: P2.1 38.63,24.5 38.25,24.88 R40.2 C30.2 | C29.2 R52.2 51.2,39.46 U8.1 | 23.28,48.83 C32.1 C31.1 24.16,51.01 R36.2 | 40.28,49.97 C21.2 | 24.28,45.42 23.9,45.04 v23.5,45.04 23.28,45.26 | P5.6 v40.29,43.92 40.29,39.7 44.66,35.33 47.03,35.33 | 47.03,35.33 48.67,35.33 C29.2 | P3.1 46.8,35.1 47.03,35.33 | C21.2 40.28,49.81 P5.6 | 39.93,47.85 39.93,46.1 40.06,46.1 40.08,46.13 40.08,47.9 | U9.10 U9.9 51.74,37.17 50.51,37.17 C29.2 | C20.2 40.21,49.89 C21.2 | U9.1 58.61,32.43 58.65,32.38
  Top 0.305: v27.26,45.03 26.78,45.51 P5.33 | P5.12 37.28,44.22 v37.58,43.92
  Top 0.813: v34.37,43.94 28.35,43.94 v27.26,45.03 | 39.42,10.41 39.42,9.2 39.53,9.1 | 39.42,10.46 39.42,22.89 38.66,23.65 | R1.2 39.53,9.1 | 39.53,9.1 52.56,9.1 55.86,12.39 C23.2 C24.2 R43.2 R44.2 R42.2 R47.2 55.85,26.84 C34.2 C33.2 R54.2 55.86,32.99 | 38.15,9.2 39.42,10.46 | 39.42,10.46 39.42,10.41 | 39.42,10.41 40.72,9.12 | 55.86,32.99 54.99,33.86 54.99,35.76 53.85,36.91 52.01,36.91 51.74,37.17 | 55.86,32.99 56.47,32.38 56.7,32.38 | 56.7,32.38 58.65,32.38 59.05,32.38 | 55.91,31.52 55.91,31.6 56.7,32.38
  Bottom 0.813: v40.29,43.92 v37.58,43.92 34.39,43.92 v34.37,43.94 | v27.26,45.03 v23.51,45.03 v23.5,45.04
  pour Top: 37.75,29.08 37.75,24.16 38.79,23.11 39.3,23.11 39.32,23.09 39.32,25.76 38.86,26.21 38.86,29.08
  pour Top: 24.67,51.64 22.25,51.64 22.13,51.51 22.13,46.08 23.22,44.98 24.36,44.98 24.36,47.7 24.23,47.7 24.23,45.72 24.01,45.49 23.55,45.49 23.4,45.64 23.4,48.92 23.12,49.2 23.12,50.14 23.47,50.5 24.67,50.5
  pour Top: 38.08,50.42 38.08,49.66 38.28,49.45 39.35,49.45 39.63,49.17 39.63,39.62 44.38,34.87 45.72,34.87 46.18,34.42 46.18,32.28 46.87,32.28 46.87,34.47 47.35,34.95 49.66,34.95 51.08,36.37 53.47,36.37 53.47,37.47 52.28,37.47 51.77,37.97 51.77,40.39 51.69,40.46 50.73,40.46 50.68,40.41 50.68,39.73 49.74,38.79 49.74,36.4 49,35.66 44.81,35.66 40.36,40.11 40.36,47.96 40.69,48.29 40.69,50.34 40.62,50.42
5V
  Top 0.813: U4.3 22.96,15.22 D5.C R51.1 25.65,16.73 C16.1
+3V3  (via drill 0.3)  (2 unrouted)
  Top 0.254: D3.A 20.62,10.91 R23.2 22.16,9.06 R53.1 v23.51,9.17 | D3.A 20.56,12.54 C26.1 | D3.A R22.2 18.03,12.76 C22.1 18.56,13.51 U4.2 U4.4 17.97,18.66 R28.1 | C27.1 R28.1 | IC1.5 IC1.6 19.34,24.04 17.97,22.67 R28.1 | 24.58,9.17 R1.1 | D4.4 52.84,58.28 52.02,58.28 R72.2 50.9,57.93 | R70.2 44.45,58.01 | 44.45,58.01 R71.2 45.08,58.02 R69.2 46.65,58.01 R68.2 | R68.2 48.3,57.95 R67.2 49.99,57.93 50.9,57.93 | C54.2 50.9,56.16 50.9,57.93 | U7.3 48.25,56.66 R68.2 | 44.45,58.01 44.45,56.52 U5.3 43.33,56.49 v43.08,56.24 v43.07,56.24 42.01,56.24 | C42.1 42.01,55.75 42.01,56.24 | 42.01,56.24 R21.1
  Top 0.305: P4.14 54.32,47.5 v54.68,47.14
  Top 0.61: v57.85,42.82 57.85,45.63 56.34,47.14 v54.68,47.14 | R87.1 48.06,48.61 | 48.06,48.61 R86.1 | SD.4 v47.05,68.46 | v48.13,49.4 48.13,48.68 48.06,48.61
  Top 0.813: 24.58,9.17 v23.51,9.17 | v52.91,62.1 52.91,58.35 52.84,58.28 | J3.1 20.03,74.98 C17.1 20.44,75 20.88,75.44 22.04,75.44 U6.2 | U2.VDD33 v25.12,75.44
  Bottom 0.254: v48.13,49.4
  Bottom 0.813: v25.12,75.44 49.65,75.44 52.91,72.18 52.91,69.55 | v43.08,56.24 49.03,50.29 | v23.51,9.17 52.13,9.17 57.85,14.89 v57.85,42.82 | 48.64,50.67 48.67,50.65 48.67,50.39 48.9,50.16 | 49.03,50.29 52.18,47.14 v54.68,47.14 | 52.91,68.61 52.91,67.39 | 52.91,67.39 v52.91,62.1 | v47.05,68.46 52.77,68.46 52.91,68.61 | 51.82,68.48 52.91,67.39 | 52.91,68.61 52.91,69.55 | 52.91,69.55 51.82,68.45 | v48.13,49.4 v48.14,49.4 | v48.14,49.4 48.9,50.16 | 48.9,50.16 49.03,50.29 | v48.14,49.4 49.91,49.4 | 48.11,49.4 48.11,51.18
  pour Top: 22.08,24.82 18.88,24.82 16.03,21.97 16.03,20.7 17.17,19.56 17.17,16.81 17.94,16.05 17.94,10.26 19.54,8.66 25.05,8.66 25.15,8.76 25.15,9.8 25.02,9.93 21.87,9.93 21.42,10.39 21.42,13.13 20.93,13.61 19.87,13.61 19.18,14.3 19.18,16.05 19.74,16.61 19.74,19.41 18.67,20.47 18.67,23.09 19.43,23.85 21.75,23.85 22.08,23.85
  pour Top: 41.51,55.17 42.6,55.17 43.31,55.88 51.54,55.88 51.56,55.91 53.47,57.81 54.03,57.81 54.03,58.7 53.6,58.7 53.19,59.11 52.78,59.11 52.2,58.52 43.06,58.52 42.98,58.45 42.98,58.19 42.65,57.86 41.53,57.86 41.51,57.84
CLK
  Top 0.254: U2.CLK 35.59,53.85 31.68,57.76 U6.20
CMD
  Top 0.254: U2.CMD 26.65,53.85 30.43,57.63 30.43,58.7 U6.19
CSI_1V2
  Top 0.254: P4.15 52.06,47 51.77,47.3 51.77,48.27 C14.1 48.94,51.1 C13.1 49.03,52.56 U7.2
CSI_2V8
  Top 0.254: P4.21 49.98,44 49.69,44.3 49.69,49.55 49.18,50.06 46.39,50.06 C11.1 C12.1 45.41,53.97 U5.2
CSI_D0  (via drill 0.3)  (1 unrouted)
  Top 0.254: J3.13 13.11,44.5 11.31,46.3 11.31,69.07 v11.28,69.09 | P4.6 54.99,51.5 v55.65,52.16 | U2.IO5 v41.32,65.28 | U6.29 39.16,65.29 37.04,67.41 37.04,69.83 v37.02,69.85
  Bottom 0.254: v11.28,69.09 11.29,69.1 17.07,69.1 18.64,70.67 36.2,70.67 v37.02,69.85 | v55.65,52.16 53.69,52.16 41.32,64.54 v41.32,65.28
CSI_D1  (via drill 0.3)  (1 unrouted)
  Top 0.254: J3.12 14.71,47.04 11.89,49.86 11.89,69.64 v11.84,69.69 | P4.4 54.38,52.5 55.13,53.25 v55.13,53.91 55.15,53.9 | U2.IO18 v41.33,66.55 | U6.30 39.11,66.56 37.77,67.89 v37.77,69.88 v37.78,69.89
  Bottom 0.254: v11.84,69.69 11.85,69.68 16.83,69.68 18.39,71.24 36.44,71.24 v37.78,69.89 | v55.13,53.91 55.13,53.65 54.84,53.37 53.21,53.37 42.12,64.46 42.12,65.76 v41.33,66.55
CSI_D2  (via drill 0.3)  (1 unrouted)
  Top 0.254: J3.11 14.38,49.58 12.45,51.51 12.45,70.19 v12.42,70.22 | P4.3 54.07,53 54.46,53.39 v54.46,53.94 v54.45,53.95 | v41.32,67.82 U2.IO19 40.03,67.84 39.02,67.84 38.5,68.36 v38.5,69.89
  Bottom 0.254: v12.42,70.22 13.24,70.21 16.56,70.21 18.16,71.81 36.83,71.81 38.5,70.14 v38.5,69.89 | v54.45,53.95 53.49,53.95 42.68,64.76 42.68,66.47 v41.32,67.82
CSI_D3  (via drill 0.3)  (1 unrouted)
  Top 0.254: J3.10 14.23,52.12 13.03,53.31 13.03,70.79 v12.98,70.84 | P4.5 54.67,52 55.65,52.98 55.65,53.44 v55.71,53.49 | v41.32,70.35 v41.31,70.36 U2.IO21 39.23,70.36 v38.35,71.24
  Bottom 0.254: v12.98,70.84 16.33,70.84 17.86,72.37 37.22,72.37 v38.35,71.24 | v55.71,53.49 55.71,54.2 55.4,54.51 53.81,54.51 43.23,65.08 43.23,68.43 v41.32,70.35
CSI_D4  (via drill 0.3)  (1 unrouted)
  Top 0.254: P4.7 55.41,51 v56.1,51.69 | J3.3 18.44,69.9 21.44,72.9 22.04,72.9 U6.4 | U2.SENSOR_VP 23.06,72.9 25.91,70.05 v25.91,69.29
  Bottom 0.254: v56.1,51.69 56,51.59 53.44,51.59 40.79,64.24 30.96,64.24 v25.91,69.29
CSI_D5  (via drill 0.3)  (1 unrouted)
  Top 0.254: P4.9 56.26,50 v56.65,50.38 | J3.4 21.49,71.63 U2.SENSOR_VN 23.24,71.63 24.97,69.9 v24.97,69.19
  Bottom 0.254: v56.65,50.38 53.82,50.38 40.5,63.7 30.49,63.7 25,69.19 v24.97,69.19
CSI_D6  (via drill 0.3)
  Top 0.254: P4.11 56.44,49 v56.49,48.95 | v23.99,69.23 22.86,70.36 U2.IO34 U6.6
  Bottom 0.254: v56.49,48.95 56.08,49.36 53.93,49.36 40.21,63.08 30.14,63.08 v23.99,69.23
CSI_D7  (via drill 0.3)
  Top 0.254: P4.13 55.48,48 55.65,47.83 56.44,47.83 v56.5,47.89 | J3.5 21.49,69.09 U2.IO35 U6.7 22.6,69.1 22.61,69.09 22.96,69.09 v23.53,68.52
  Bottom 0.254: v56.5,47.89 56.44,47.83 55.83,47.83 55.32,48.34 53.22,48.34 39.73,61.83 29.53,61.83 23.53,67.83 v23.53,68.52
CSI_HSYNC  (via drill 0.3)  (1 unrouted)
  Top 0.254: J3.9 14.43,54.66 13.59,55.5 v13.59,73.22 v13.6,73.23 | v56.26,46.05 55.81,46.5 P4.16 | U2.IO23 41.4,75.44 42.19,74.65 v42.19,73.79 v42.2,73.78 | U6.37 38.78,75.45 v37.9,74.57
  Bottom 0.254: v37.9,74.57 14.94,74.57 v13.6,73.23 | v56.26,46.05 57.25,47.04 57.25,54.38 55.96,55.68 54.24,55.68 44.43,65.49 44.43,71.55 v42.2,73.78
CSI_MCLK  (via drill 0.3)
  Top 0.254: P4.12 55.97,48.5 v56.05,48.42 | J3.6 18.62,62.28 19.31,62.97 19.31,66.12 21.01,67.82 22.04,67.82 U6.8 U2.IO32 23.95,67.82 v24.19,68.06
  Bottom 0.254: v56.05,48.42 55.68,48.79 53.63,48.79 40.01,62.41 29.82,62.41 24.19,68.03 v24.19,68.06
CSI_PCLK  (via drill 0.3)  (1 unrouted)
  Top 0.254: J3.7 14.58,59.74 14.1,60.22 14.1,72.7 v14.24,72.83 | v56.32,52.66 56.67,52.32 56.67,51.31 55.86,50.5 P4.8 51.45,50.5 C19.1 | U2.IO22 41.33,74.17 41.58,73.91 v41.58,73.16 | U6.36 38.71,74.18 v38.64,74.24
  Bottom 0.254: v14.24,72.83 15.39,73.99 38.39,73.99 v38.64,74.24 | v56.32,52.66 56.32,54.53 55.76,55.09 54.07,55.09 43.84,65.31 43.84,70.9 v41.58,73.16
CSI_RST  (via drill 0.3)
  Top 0.254: R53.2 22.27,5.77 R33.2 | v55.52,42.79 v55.51,42.78 55.53,42.8 55.53,44.02 54.55,45 P4.19
  Top 0.61: v22.26,6.56 22.26,7.57 22.27,7.56 22.27,5.77 24.23,5.77 C43.1
  Bottom 0.254: v22.26,6.56 22.26,9.27 23.05,10.06 51.57,10.06 56.87,15.36 56.87,42.2 56.26,42.8 55.53,42.8 v55.51,42.78
CSI_VSYNC  (via drill 0.3)  (1 unrouted)
  Top 0.254: P4.18 54.31,45.5 v54.44,45.64 | J3.8 19.36,57.2 19.89,57.73 19.89,64.11 21.06,65.28 22.04,65.28 U6.10 | U2.IO25 v23.48,65.28
  Bottom 0.254: v23.48,65.28 25.3,65.28 29.32,61.26 39.51,61.26 52.89,47.88 55.1,47.88 55.45,47.52 55.45,46.64 v54.44,45.64
D+
  Top 0.254: IC1.3 20.13,25.54 19.02,26.65 USB.A6 11.53,26.65 11.25,26.37 11.25,25.7 11.56,25.39 12.17,25.39 12.43,25.65 USB.B6
D-  (via drill 0.3)
  Top 0.254: IC1.4 19.73,25.04 18.62,26.15 USB.A7 11.98,26.15 v11.95,26.12 | USB.B7 12.09,27.15 v11.85,27.39
  Bottom 0.254: v11.85,27.39 11.85,26.22 v11.95,26.12
DTR  (via drill 0.3)
  Top 0.254: IC1.23 22.79,27.95 22.67,28.07 21.63,28.07 21.44,27.88 v21.44,27.11 | v15.38,9.09 14.95,9.09 14.86,9
  Top 0.61: Q3.2 14.86,9 15.93,9 R26.2
  Bottom 0.254: v21.44,27.11 16.66,27.11 15.5,25.95 15.5,9.21 v15.38,9.09
GND  (via drill 0.3)  (1 unrouted)
  Top 0.254: IC1.2 22.79,26.04 IC1.THERM | R48.2 17.58,25.4 v17.63,25.45 | v17.07,28.68 17.58,28.17 17.58,27.64 | P4.10 57.02,49.5 57.99,50.47 | P5.37 24.78,47.84 25.23,48.28 28.43,48.28 v29.16,49.02 | 27.28,47.42 27.38,47.52 35.28,47.52 35.28,46.48 27.28,46.48 27.28,47.24 27.33,47.3 35.11,47.3 35.11,46.71 27.49,46.71 27.49,47.09 34.93,47.09 34.93,46.91 27.56,46.91 | P5.17 P5.18 | SD.G1 46.36,62.28 v46.36,64.44 | U2.GND_2 25.12,58.93 U6.15
  Bottom 0.254: 17.63,28.12 v17.07,28.68
  other vias: 16.94,14.1 9.02,24.61 8.87,27.58 8.26,28.68 9.32,32.61 8.64,38.51 8.74,36.45 7.57,24.84 9.73,20.65 7.57,13.61 7.01,1.93 6.58,4.14 7.62,6.68 9.5,2.97 29.01,3.94 29.24,6.45 26.24,13.31 30.66,12.93 35.49,12.83 37.21,16.28 57.28,2.36 58.07,4.52 57.53,9.78 47.27,7.29 38.2,5.89 50.9,13.56 49.48,15.85 59.01,21.36 59.16,43.21 59.26,60.66 57.33,67.89 56.29,69.9 58.32,79.91 59.67,81.81 56.37,82.32 53.9,80.85 60.23,79.07 53.47,75.21 47.88,73.56 57.48,74.96 29.57,69.44 31.52,69.44 33.94,69.57 36.07,69.47 29.11,76.48 36.91,65.81 33.63,65.51 32.08,65.38 33.91,67.61 35.59,67.61 30.56,67.72 32.06,68.22 32.03,66.85 28.6,68.71 27.31,60.88 29.21,60.43 31.55,60.38 33.99,60.4 36.22,60.45 36.12,76.61 35.51,65.18 33.38,76.45 9.86,72.92 8.49,65.89 8.61,60.2 8.31,53.54 8.26,47.8 7.9,44.73 7.85,78.69 7.65,82.6 9.99,80.8 12.55,74.73 42.22,52.1 43.16,48.95 47.15,44.09 44.45,48.26 44.43,37.62 52.4,28.47 50.96,28.37 41.35,28.65 43.44,28.57 34.52,21.23 38.48,20.02 28.22,38.3 32.62,38.3 30.36,36.98 29.75,41.78 21.85,40.59 31.02,49.05 32.79,55.19 31.24,54.38 50.8,66.83 57.64,64.44 50.27,47.73 49.08,66.4 55.63,45.49 47.07,22.02 26.75,23.67 28.2,22.63 11.33,17.48 22.66,25.96 23.32,25.98 24.11,25.98 24.49,25.35 23.73,25.32 22.96,25.32 22.74,24.51 23.57,24.49 24.39,24.54 46.64,66.12 53.37,41.53
  pour Top (rank 6): -15.31,97.03 -15.31,-11.93 91.14,-10.92 91.14,98.04
  pour Bottom (rank 6): -14.78,-11.68 99.27,-11.68 99.27,98.04 -14.78,98.04
IM1
  Top 0.254: R35.2 25.76,49.54 R36.1 23.78,49.11 P5.39
IO0/LCD_IRQ  (via drill 0.3)  (1 unrouted)
  Top 0.254: Q3.3 13.9,11.04 13.94,11.08 | v40.94,26.15 40.74,25.95 P2.4 40.74,11.58 v40.45,11.29 | U8.7 45.94,41.96 | 45.94,41.96 45.37,41.96 | 45.37,41.96 44.87,41.46 | 45.94,41.96 45.95,41.97 45.95,42.58 | 48.8,28.97 P3.5 48.8,34.27 49.1,34.57 50.09,34.57 51.41,35.89 52.99,35.89 U9.11 | 48.8,28.97 48.8,26.46 | v48.93,29.02 48.85,29.02 48.8,28.97 | 44.87,41.46 44.87,38.46 v45.73,37.6 | 46.33,41.96 46.31,41.96 45.95,42.32 45.6,41.96 45.37,41.96 | R42.1 51.2,23.63 48.8,26.03 48.8,26.46 | 48.8,26.46 v48.93,26.59 | 44.87,41.46 44.87,41.5 46.49,43.12 46.49,47.62 v46.4,47.71 | U2.IO0 39.2,60.2 v38.75,59.75
  Top 0.61: 13.9,11.04 16.45,11.04 | 16.45,11.04 R22.1 | 16.45,11.04 16.45,11.18 v17.06,11.79 | SJ1.2 13.94,16.47 R24.2 13.94,11.08
  Bottom 0.254: v48.93,29.02 47.19,29.02 45.73,30.48 v45.73,37.6 | v40.45,11.29 17.55,11.29 v17.06,11.79 | v48.93,26.59 48.65,26.31 41.1,26.31 v40.94,26.15 | v46.4,47.71 46.4,51.57 38.76,59.21 38.76,59.74 v38.75,59.75
IO2/SPI_NCS2  (via drill 0.3)
  Top 0.254: v44.16,38.76 44.16,41.54 45.96,43.34 45.96,47.12 v45.72,47.36 | U9.15 51.11,33.27 v50.45,32.61 | R54.1 54.34,31.06 | 54.34,31.06 54.34,32.89 53.95,33.27 U9.15 | U9.15 | v54.44,31.09 54.37,31.09 54.34,31.06 | U6.24 36.97,58.93 U2.IO2 38.14,58.93 v38.12,58.95
  Top 0.406: SJ1.1 16.52,18.55 v16.55,18.55 | U2.IO2 41.95,58.93 R21.2
  Bottom 0.254: v44.16,38.76 45.23,39.83 47.33,39.83 47.62,39.54 47.62,34.55 49.55,32.61 v50.45,32.61 | v16.55,18.55 51.55,18.55 54.42,21.42 54.42,31.07 v54.44,31.09 | v45.72,47.36 45.72,51.35 v38.12,58.95
IO4  (via drill 0.3)
  Top 0.254: SD.2 45.11,70.68 49.25,70.68 49.97,69.96 v49.97,63.58 R67.1 | U2.IO4 42.02,61.47 42.6,62.05 42.6,69.19 44.07,70.66 SD.2 | D4.1 v56.03,60.08
  Top 0.406: U2.IO4 U6.26 | SD.2
  Bottom 0.254: v49.97,63.58 53.47,60.08 v56.03,60.08
IO12/HMISO  (via drill 0.3)  (1 unrouted)
  Top 0.254: D6.- 35.06,51.5 R2.1 v33.66,51.49 | v33.03,48.31 33.66,48.94 v33.66,51.49 | v33.66,51.49 32.61,52.54 21.05,52.54 20.5,53.09 20.5,59.74 20.96,60.2 22.04,60.2 U6.14 | 33.66,50.95 33.66,51.1 34.04,51.49 v33.66,51.49 | U9.12 v51.85,35.22 v51.84,35.23 | v46.92,65.09 45.16,65.09 SD.7 44.26,65.16 43.18,64.08 43.18,60.09 43.46,59.81 R70.1 | v53.84,57.13 53.93,57.05 55.12,57.05 55.39,57.32 D4.6
  Bottom 0.254: v33.03,48.31 33.03,41.92 34.91,40.04 42.93,40.04 44.23,41.34 48.1,41.34 49.26,40.18 49.26,36.94 50.97,35.23 v51.84,35.23 | v33.66,51.49 39.18,45.97 52.06,45.97 53.32,44.71 57.06,44.71 57.79,45.44 57.79,54.71 56.32,56.19 54.63,56.19 53.69,57.13 | 53.69,57.13 46.92,63.9 v46.92,65.09 | 53.69,57.13 v53.84,57.13
IO13/HMOSI  (via drill 0.3)
  Top 0.254: SD.3 47.37,69.56 48.25,68.69 v48.25,65.1 R68.1 | v36.94,39.43 36.67,39.7 v36.67,45.72 36.78,45.83 P5.13 | U9.14 51.85,33.92 v51.57,34.21 | D4.3 53.89,59.42 v53.87,59.4 | U2.IO13 22.38,57.33 24.49,57.33 | 24.49,57.33 26.06,57.33 26.6,57.87 U6.16 | v24.47,57.27 24.49,57.29 24.49,57.33
  Bottom 0.254: v24.47,57.27 24.47,53.14 26.63,50.98 32.48,50.98 36.67,46.79 v36.67,45.72 37.45,44.94 51.39,44.94 52.84,43.49 57.41,43.49 58.81,44.89 58.81,55.55 55.65,58.7 53.89,58.7 53.59,59 | v36.94,39.43 43.1,39.43 44.48,40.81 47.91,40.81 48.77,39.95 48.77,35.87 50.42,34.21 v51.57,34.21 | 53.59,59 48.25,64.34 v48.25,65.1 | v53.87,59.4 53.59,59.12 53.59,59
IO14/HSCLK  (via drill 0.3)  (1 unrouted)
  Top 0.254: v38.45,38.75 38.51,38.81 v38.51,45.61 37.95,45.61 37.78,45.78 P5.11 | U9.16 51.75,32.62 v51.74,32.61 | R69.1 47.58,60.67 47.58,66.45 | 47.58,66.45 46.66,67.36 SD.5 | D4.5 54.64,57.63 v54.65,57.62 | 47.58,66.45 47.57,66.44 v47.57,65.64 | U2.IO14 v23.56,61.47
  Bottom 0.254: 38.66,45.61 32.75,51.52 27.12,51.52 25.12,53.52 25.12,60.33 23.97,61.47 v23.56,61.47 | 38.66,45.61 38.8,45.47 51.67,45.47 53.03,44.11 57.19,44.11 58.32,45.24 58.32,55.07 55.56,57.83 54.45,57.83 | 38.66,45.61 v38.51,45.61 | v38.45,38.75 43.17,38.75 44.77,40.35 47.66,40.35 48.21,39.8 48.21,34.82 49.68,33.35 51.01,33.35 v51.74,32.61 | v47.57,65.64 47.57,64.12 53.86,57.83 54.45,57.83 | 54.66,57.63 v54.65,57.62 | v54.65,57.62 54.65,57.67 | 54.45,57.83 v54.65,57.62
IO15/HNSS0  (via drill 0.3)
  Top 0.254: v39.03,48.54 38.78,48.29 P5.9 | U6.23 35.49,57.8 36,57.3 v37.5,57.3 v37.51,57.31 39.7,57.31 U2.IO15
  Bottom 0.254: v39.03,48.54 39.03,55.8 v37.51,57.31
IO16  (1 unrouted)
IO17  (1 unrouted)
IO33/LCD_RS  (via drill 0.3)  (1 unrouted)
  Top 0.254: v36.1,49.92 R34.2 38.28,48.48 P5.10 | v24.66,61.78 24.66,65.33 23.45,66.55 U2.IO33
  Bottom 0.254: v36.1,49.92 33.96,52.05 27.54,52.05 25.68,53.92 25.68,60.77 v24.66,61.78
LCD_BCK
  Top 0.406: R41.2 R31.2
N$1
  Top 0.254: IC1.16 27.28,25.54 C18.1
N$2
  Top 0.61: Q4.1 18.18,8.28 R26.1
N$3
  Top 0.61: R25.1 12.73,8.72 Q3.1
N$4
  Top 0.254: R2.2 D6.+ 36.28,48.3 P5.14
N$5
  Top 0.61: R50.1 29.62,20.12 R45.2 31.33,20.08 Q2.1
N$6
  Top 0.61: FLASH.2 | FLASH.2 R24.1
N$7
  Top 0.254: 24.4,10.97 R16.2
  Top 0.61: D3.C 22.71,10.92 R16.2
N$8
  Top 0.254: 29.45,15.15 29.81,15.15 LED1.1
  Top 1.016: R51.2 29.45,15.15
N$9
  Top 0.61: Q2.3 33.43,16.14 LED1.2
N$10
  Top 0.305: USB.A5 R46.1
N$11
  Top 0.305: USB.B5 R48.1
N$12
  Top 0.254: R28.2 R27.2 21.06,22.71 21.64,23.29 IC1.7
  pour Top: 22.28,23.57 21.54,23.57 21.31,23.34 19.66,23.34 19.33,23.01 19.26,22.94 19.26,20.83 19.43,20.65 21.47,20.65 21.47,22.5 21.87,22.91 21.97,23.01 22.25,23.01 22.28,23.04
N$18
  Top 0.254: IC1.21 23.79,28.2 24.22,28.63 27.36,28.63 R29.2
N$19
  Top 0.254: IC1.20 24.29,27.91 24.51,28.13 26.08,28.13 26.52,27.69 26.52,26.92 26.96,26.48 R30.2
N$20
  Top 0.254: R37.1 20.09,34.17 26.28,40.36 P5.34
N$21  (1 unrouted)
  Top 0.254: P5.35 25.78,40.69 18.33,33.24 R38.1
N$22
  Top 0.254: R39.1 17.81,34.57 18.89,34.57 25.28,40.96 P5.36
N$23
  Top 0.406: R40.1 Q5.1 34.39,25.61 R41.1
N$24
  Top 0.254: R39.2 R38.2 R37.2 20.09,30.11 21.02,29.18 30.87,29.18 Q5.3
N$25
  Top 0.254: R49.2 48.58,38.36 R52.1 | U8.8 45.78,41.46 45.38,41.06 45.38,38.91 45.93,38.36 R49.2 | 46.94,38.35 R49.2
N$47
  Top 0.254: SD.1 50.11,71.76 51.67,70.19 R72.1
N$48  (1 unrouted)
  Top 0.254: 45.06,64.03 45.04,64.06 44.22,64.06 43.69,63.52 43.69,61.39 45.07,60.01 R71.1
NC  (1 unrouted)
PWDN
  Top 0.254: P4.17 51.47,46 R32.1
RESET  (via drill 0.3)  (2 unrouted)
  Top 0.254: 20.67,7.49 R23.1 20.58,7.5 | v41.24,10.67 P2.5 41.24,25.51 41.51,25.78 v42.55,25.78 | 35.78,45.51 v35.78,37.18 v35.79,37.17 | P3.6 49.3,29.53 49.57,29.26 v49.57,28.42 49.57,26.38 50.05,25.9 | v35.67,45.53 35.69,45.51 35.78,45.51 | P5.15 35.78,45.51 | R47.1 50.73,25.22 50.05,25.9 | 50.05,25.9 v50.05,25.88 | v23.84,60.42 25.78,60.42 26.57,61.21 26.57,70.84 23.24,74.17 22.06,74.17 U6.3
  Top 0.61: RST.2 9.37,6.41 11.03,4.75 Q4.3 20.57,4.74 20.67,4.65 | C28.1 20.67,4.65 | 20.67,4.65 R33.1 20.67,6.65 v20.65,6.67 20.65,7.51 R23.1 | 19.66,4.78 20.45,5.56 20.53,5.56 19.71,4.75 19.61,4.75 20.48,3.89 20.53,3.89
  Bottom 0.254: 45.19,35.16 45.19,35.13 | 45.19,35.13 45.19,30.28 47.05,28.42 v49.57,28.42 | v35.79,37.17 43.15,37.17 45.19,35.13 | v35.67,45.53 35.67,46.97 32.16,50.48 26.26,50.48 23.86,52.88 23.86,60.4 v23.84,60.42 | v20.65,6.67 20.65,8.77 22.55,10.67 v41.24,10.67 | 50,25.83 v50.05,25.88 49.95,25.78 v42.55,25.78
RTS  (via drill 0.3)
  Top 0.254: IC1.19 25.27,27.3 v25.48,27.09
  Top 0.61: R25.2 v15.31,6.78 Q4.2
  Bottom 0.254: v25.48,27.09 24.95,26.56 16.93,26.56 15.98,25.61 15.98,7.45 v15.31,6.78
RXD  (via drill 0.3)  (2 unrouted)
  Top 0.254: 30.24,27.78 31.24,26.78 31.24,21.84 R50.2 | 30.24,27.78 30.04,27.98 R29.1 29.57,28.02 | v30.5,28.02 30.25,27.78 30.24,27.78 | 30.51,28.04 30.51,27.53 30.05,27.99 | 30.05,27.99 29.87,27.99 | 30.05,27.99 30.46,27.99 | v15.37,60.96 v15.37,71.64 | U2.RXD0 38.96,71.63 38.64,71.96 v38.64,72.49
  Bottom 0.254: v30.5,28.02 29.26,29.26 21.93,29.26 15.37,35.82 v15.37,60.96 | v15.37,71.64 16.67,72.94 38.19,72.94 v38.64,72.49
SD0
  Top 0.254: U2.SD0 35.51,55.12 32.95,57.68 U6.21
SD1
  Top 0.254: U2.SD1 35.54,56.39 34.22,57.71 U6.22
SD2
  Top 0.254: U2.SD2 26.7,56.39 27.87,57.56 U6.17
SD3
  Top 0.254: U2.SD3 26.6,55.12 29.14,57.66 U6.18
TWI_SCK  (via drill 0.3)  (1 unrouted)
  Top 0.254: P2.3 40.24,26.49 v40.44,26.69 | 48.59,44.27 48.59,40.94 48.11,40.46 U8.10 v46.98,39.26 | 48.59,44.27 48.59,46.69 R86.2 | 47.8,31.82 P3.3 47.8,30.51 v47.69,30.4 47.49,30.2 47.49,26.8 | 48.59,44.27 v48.69,44.37 v48.7,44.37 | 47.49,26.8 47.49,25.34 52.35,20.47 R43.1 | J3.14 12.68,41.96 12.16,42.48 | 12.16,42.48 10.7,43.94 v10.7,62.75 | 12.16,42.48 v11.99,42.48 | P4.20 54.08,44.5 54.87,43.71 v54.87,42.92 v54.87,42.91 | v47.37,26.92 47.49,26.8 | U2.IO27 23.36,62.74 v23.37,62.75
  Bottom 0.254: v46.98,39.26 46.98,31.11 v47.69,30.4 | v48.7,44.37 51.01,44.37 52.47,42.91 v54.87,42.91 | v11.99,42.48 11.99,34.99 19.29,27.69 27.4,27.69 29.74,25.35 39.1,25.35 v40.44,26.69 40.67,26.92 v47.37,26.92 | v10.7,62.75 23.32,62.75 | 23.32,62.75 v23.37,62.75 | v23.37,62.75 23.32,62.75
TWI_SDA  (via drill 0.3)  (1 unrouted)
  Top 0.254: 48.3,29.78 P3.4 48.3,30.67 | P2.2 39.74,26.51 v39.55,26.7 | 48.09,43.8 48.09,41.31 47.74,40.96 U8.9 46.26,40.96 46.11,40.81 v46.11,39.27 | v48.19,29.78 48.3,29.78 | v47.98,43.84 48.02,43.8 48.09,43.8 | J3.15 v12.62,39.42 | v10.15,63.33 10.04,63.21 10.04,41.48 12.09,39.42 v12.62,39.42 | v12.62,39.42 v12.63,39.43 | P4.22 53.94,43.5 54.18,43.26 54.18,42.51 v54.35,42.34 | 48.09,43.8 48.09,45.62 47.43,46.28 47.43,46.9 R87.2 | R44.1 51.97,22.05 48.3,25.72 48.3,27.43 | 48.3,29.78 48.3,27.43 | v48.17,27.47 48.26,27.47 48.3,27.43 | U2.IO26 22.94,64.01 v23.45,63.5
  Bottom 0.254: v48.19,29.78 47.28,29.78 46.36,30.7 46.36,39.02 v46.11,39.27 | v47.98,43.84 50.74,43.84 52.24,42.34 v54.35,42.34 | v12.63,39.43 12.63,35.61 20.05,28.19 27.77,28.19 30.08,25.88 38.73,25.88 v39.55,26.7 40.32,27.47 v48.17,27.47 | v10.15,63.33 23.28,63.33 v23.45,63.5
TXD  (via drill 0.3)  (1 unrouted)
  Top 0.254: v32.77,26.48 R31.1 | R30.1 v30.42,26.48 | v14.7,60.96 14.7,72.08 v14.82,72.2 | U2.TXD0 39.18,72.9 v38.79,73.29
  Bottom 0.254: v32.77,26.48 v30.42,26.48 28.17,28.73 21.56,28.73 14.7,35.59 v14.7,60.96 | v14.82,72.2 16.08,73.46 38.62,73.46 v38.79,73.29
VBUS  (via drill 0.3)
  Top 0.254: IC1.8 22.79,21.32 | 22.79,21.32 R27.1 23.04,21.03 D5.A | v23.88,21.32 25.42,21.32 C25.1 C15.1 | 22.79,21.32 v23.88,21.32 | v23.88,21.32 v23.89,21.31
  Top 0.61: USB.VBUS1 v14.58,28.85 | USB.VBUS2 14.45,23.95 14.46,23.95 14.76,23.65 v14.76,23.51 v16.72,23.51
  Bottom 0.254: v23.89,21.31 23.87,21.31 23.85,21.29
  Bottom 0.61: v16.72,23.51 21.69,23.51 v23.89,21.31 | v14.58,28.85 14.76,28.67 v14.76,23.51
  pour Top: 22.53,23.75 22.53,22.45 22.02,21.95 22.02,18.26 26.04,18.26 26.04,22.07 23.62,22.07 23.04,22.66 23.04,23.75
XL  (via drill 0.3)  (1 unrouted)
  Top 0.254: U8.4 49.77,41.96 49.54,42.19 49.54,42.81 v49.65,42.92 | U9.4 57.53,34.57 56.95,35.15 56.95,37.23 v55.62,38.56 | P5.1 42.78,43.33 v43.02,43.09
  Bottom 0.254: 49.76,43.29 50.4,43.29 53.61,40.08 54.82,40.08 55.62,39.28 v55.62,38.56 | 49.76,43.29 43.22,43.29 v43.02,43.09 | v49.65,42.92 49.65,43.18 49.76,43.29 | 49.63,42.95 49.61,42.98 | 49.61,42.98 49.3,43.28 50.02,43.28 49.71,42.98 49.61,42.98
XR  (via drill 0.3)
  Top 0.254: U8.2 50.47,40.96 50.05,40.54 v50.05,40.02 | v53.78,38.21 56.04,35.95 56.04,34.27 57.03,33.27 U9.2 | P5.3 41.78,40.69 v41.74,40.65
  Bottom 0.254: v41.74,40.65 42.76,40.65 43.92,41.81 48.39,41.81 50.05,40.15 v50.05,40.02 51.86,38.21 v53.78,38.21
YD  (via drill 0.3)
  Top 0.254: U8.3 49.98,41.46 v49.85,41.33 | U9.3 57.24,33.92 56.49,34.67 56.49,36.58 v54.3,38.77 | P5.4 41.28,41.43 v41.15,41.3
  Bottom 0.254: v41.15,41.3 42.69,41.3 43.68,42.29 48.65,42.29 49.81,41.13 | v49.85,41.33 49.81,41.29 49.81,41.13 | 49.81,41.13 52.17,38.77 v54.3,38.77
YU  (via drill 0.3)  (1 unrouted)
  Top 0.254: v50.18,42.48 50.2,42.46 U8.5 | U9.5 57.72,35.22 57.41,35.53 57.41,37.82 56.06,39.17 v54.96,39.17 v54.95,39.16 | P5.2 42.28,42.49 v42.41,42.36
  Bottom 0.254: v42.41,42.36 43.14,42.36 43.57,42.79 48.89,42.79 49.62,42.06 50.24,42.06 | 50.24,42.06 50.6,42.06 53.14,39.52 54.58,39.52 v54.95,39.16 | v50.18,42.48 50.18,42.13 50.24,42.06 | v50.17,42.47 50.17,42.37 49.89,42.09 50.57,42.09 50.24,42.42 50.14,42.42

### Text on the board
tPlace: +3V3 | GND | IO36 | IO39 | IO35 | IO32 | IO22 | IO25 | IO23 | IO21 | IO19 | IO18 | IO5 | IO27 | IO26 | ESP32 TFT Touch | with Camera v1.2 | (3.5'' ili9488) | www.makerfabs.com